# EAGLE design spindle_controller (EAGLE 9.5.1)
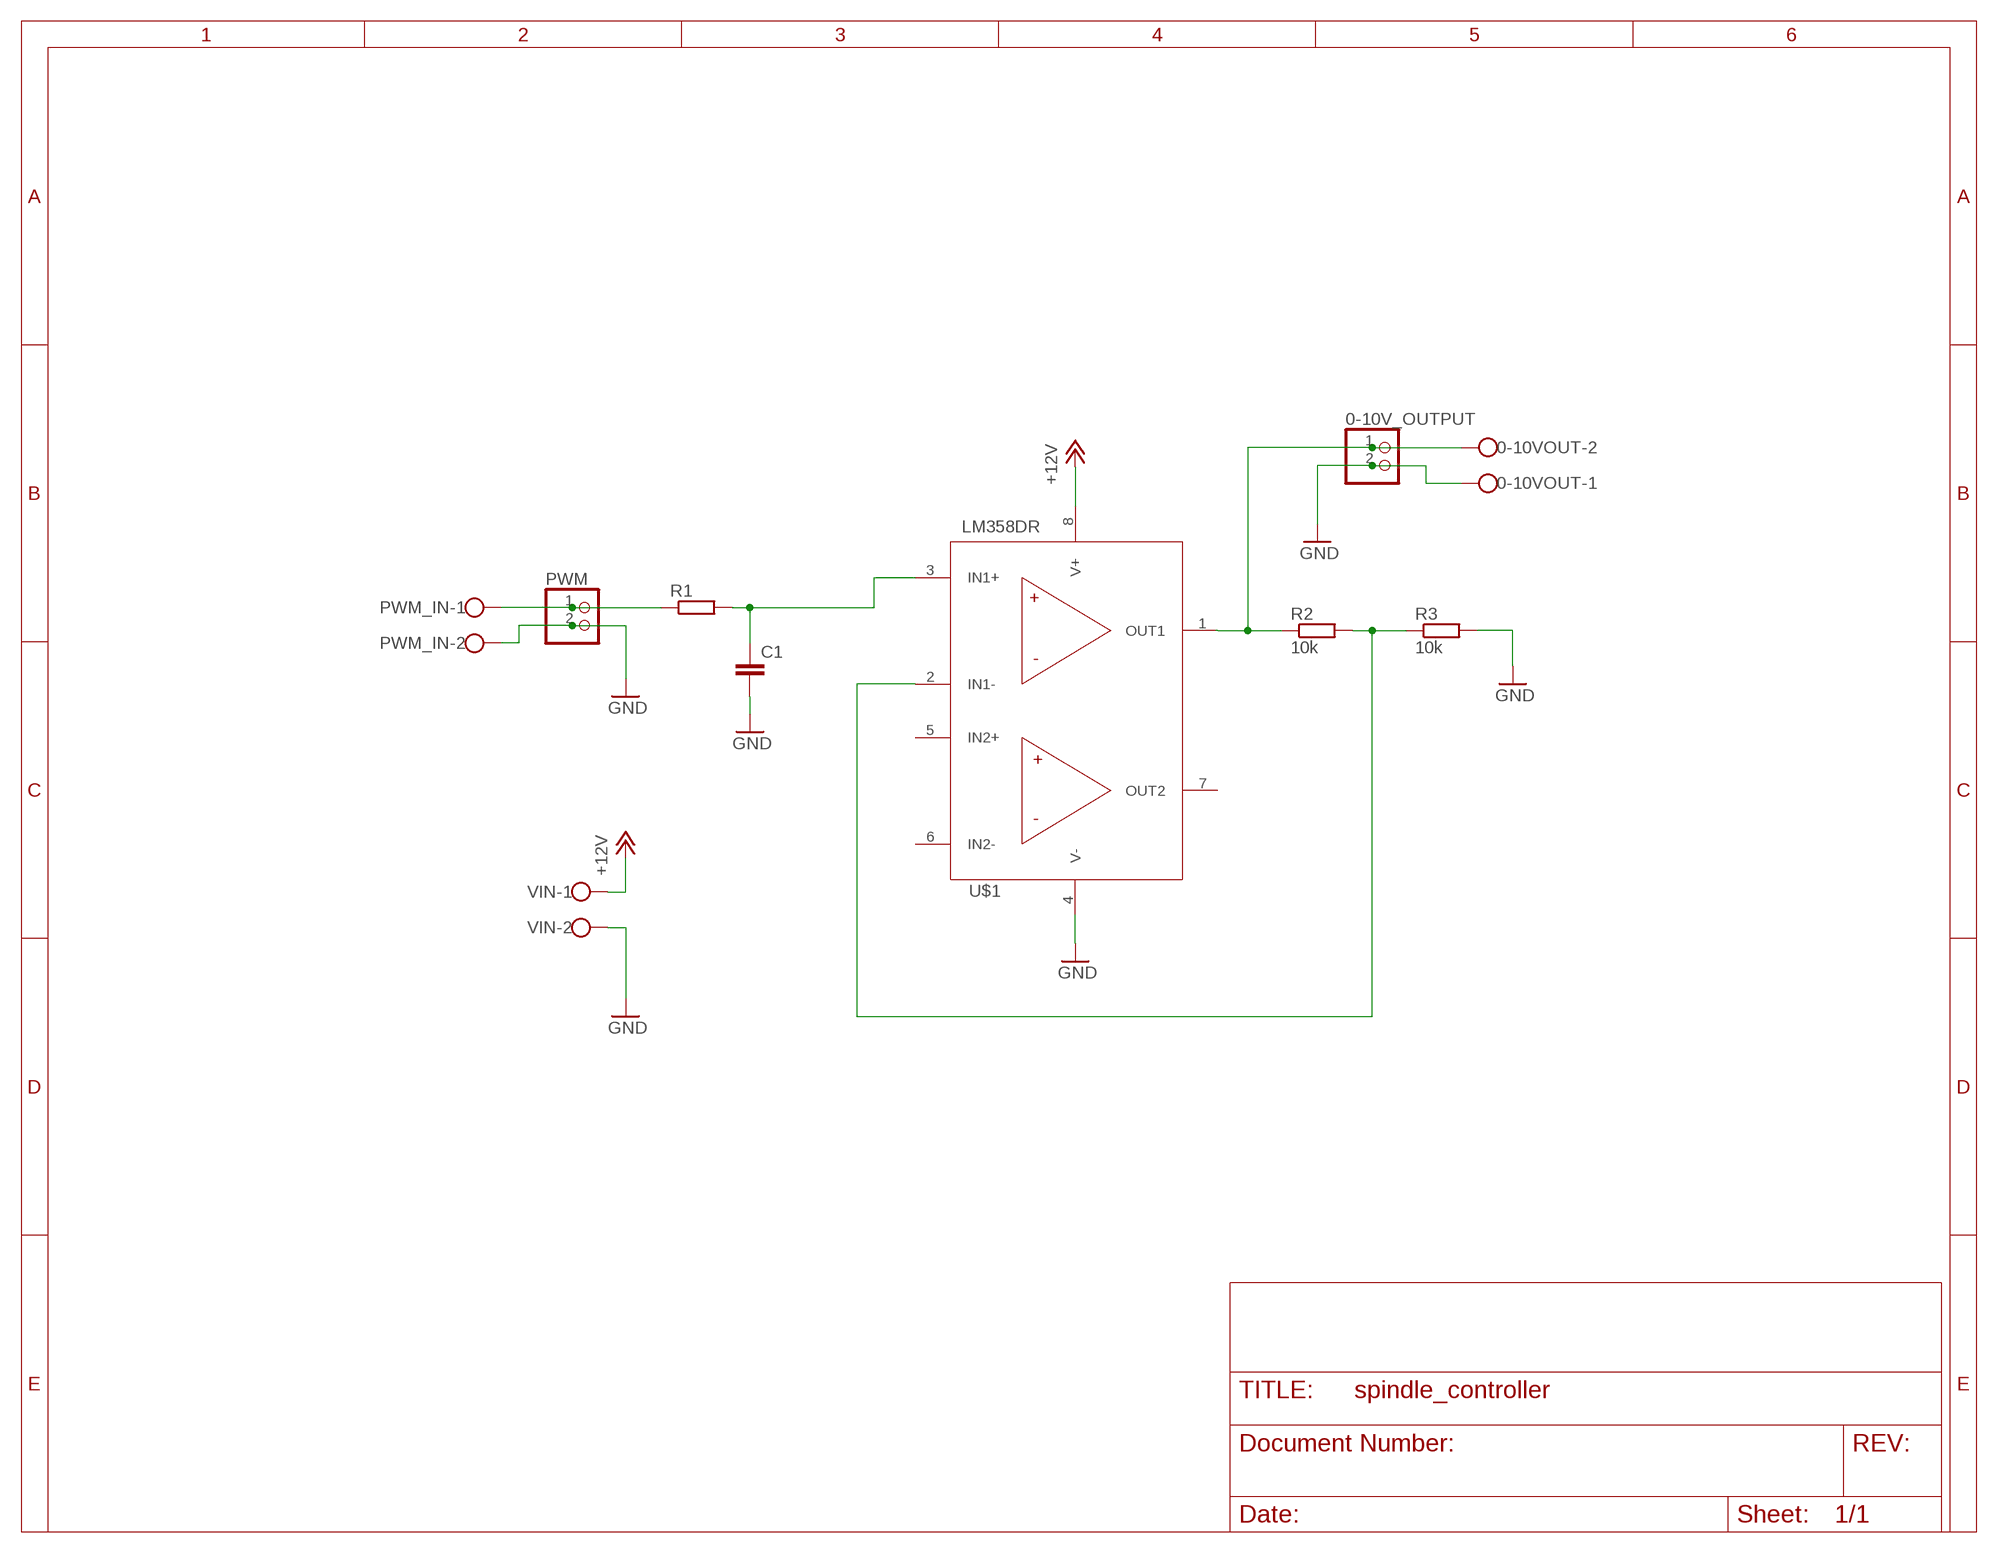
[diagram p0: schematic, sheet 1]

## Parts
0-10V_OUTPUT  PINHD-1X2  [1X02]
0-10VOUT  W237-102  [W237-102]
C1  C-EUC0603  [C0603]
PWM  PINHD-1X2  [1X02]
PWM_IN  W237-102  [W237-102]
R1  R-EU_R0603  [R0603]
R2  10k  R-EU_R0603  [R0603]
R3  10k  R-EU_R0603  [R0603]
U$1  LM358DRLM358DR_SOIC8  [SOIC127P599X175-8N]
VIN  W237-102  [W237-102]

## Nets
+12V: U$1.8(V+) VIN.1
GND: 0-10V_OUTPUT.2 0-10VOUT.1 C1.2 PWM.2 PWM_IN.2 R3.2 U$1.4(V-) VIN.2
N$1: PWM.1 PWM_IN.1 R1.1
N$2: C1.1 R1.2 U$1.3(IN1+)
N$3: R2.2 R3.1 U$1.2(IN1-)
N$4: 0-10V_OUTPUT.1 0-10VOUT.2 R2.1 U$1.1(OUT1)
Unconnected: U$1.5(IN2+) U$1.6(IN2-) U$1.7(OUT2)

## Library data of the parts
0-10V_OUTPUT PWM = pinhead:PINHD-1X2: PIN HEADER
0-10VOUT PWM_IN VIN = con-wago-500:W237-102: WAGO SCREW CLAMP; MPN: 237-102; OC_FARNELL: unknown; OC_NEWARK: 70K9898
C1 = rcl:C-EU: CAPACITOR, European symbol; SPICEPREFIX: C
R1-R3 = rcl:R-EU_: RESISTOR, European symbol; SPICEPREFIX: R
U$1 = NikodemBartnik:LM358DR: Operational Amplifiers - Op Amps Dual Op Amp 2 channel min 3V max 32V 30mA per channel

## Board
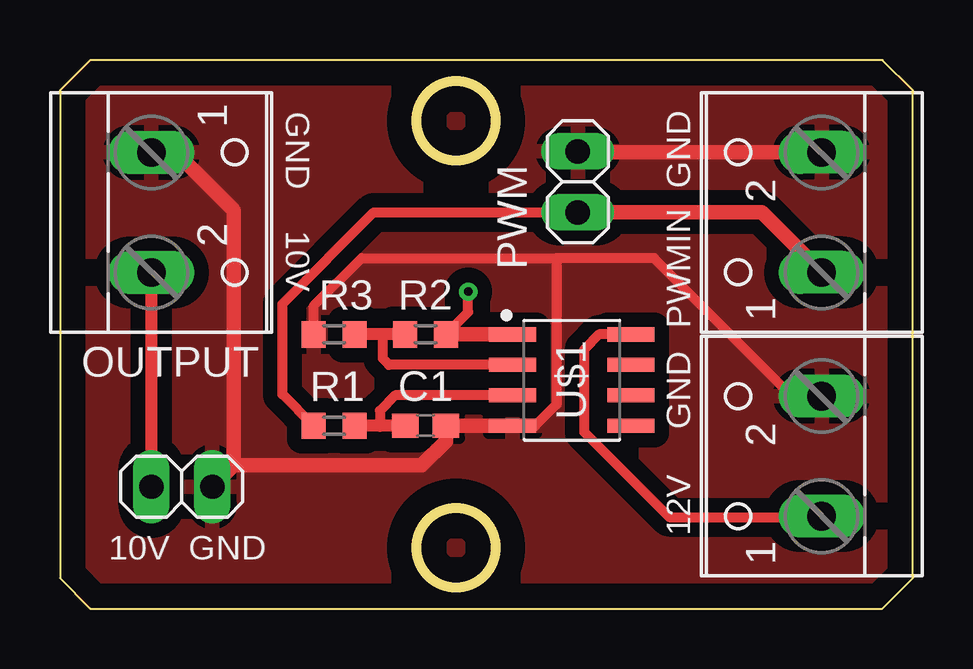
[diagram p1: board, top side]
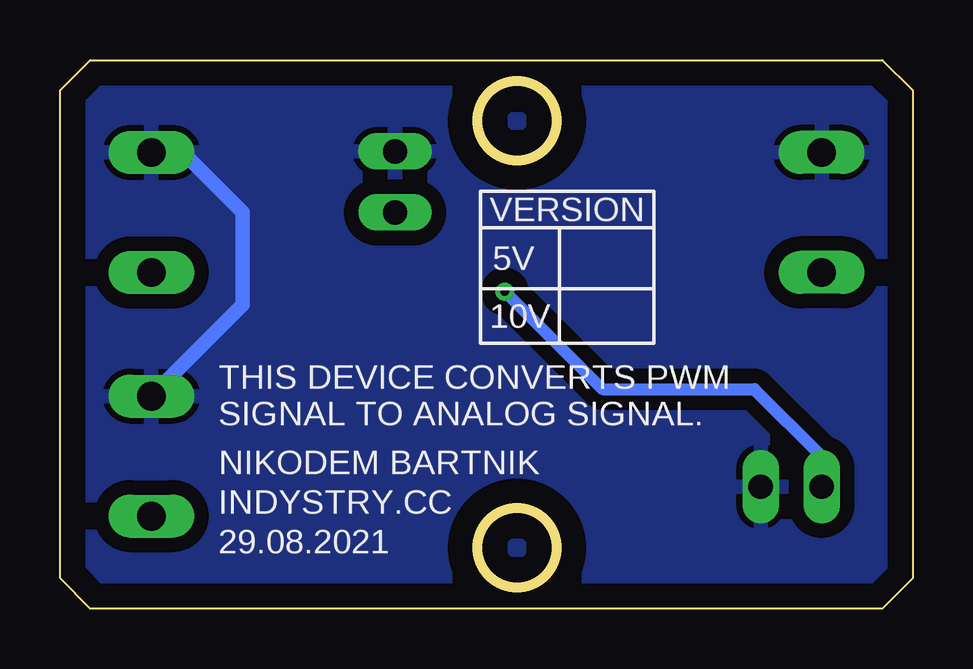
[diagram p2: board, bottom side, seen from below]

Size 35.56 x 22.86 mm. Coordinates in mm from the lower left corner, seen from the top.
Outline: 0,21.59 0,1.27 1.27,0 34.29,0 35.56,1.27 35.56,21.59 34.29,22.86 1.27,22.86 0,21.59
Outline: circle at 16.51,2.54 radius 1.65
Outline: circle at 16.51,20.32 radius 1.65
Copper layers (1*16): Top 0.035mm / dielectric 1.5mm / Bottom 0.035mm
Design rules "default": minimum track width 6mil, minimum drill 0.35mm, track to track 6mil, track to pad 6mil, pad to pad 6mil, via to via 6mil, smd to smd 6mil, copper to edge 40mil, drill to drill 6mil, minimum pad ring 10mil, minimum via ring 8mil, stop-mask expansion 4mil, vias tented up to drill 0mil, thermal gap 10mil

### Footprints (pad centres in the part's own frame; a part is rotated, then mirrored left to right if it is on the bottom)
1X02 = drill 1.016 long: 1 -1.27,0; 2 1.27,0
W237-102 = drill 1.194 long: 1 -2.5,-1.27; 2 2.5,-1.27
C0603 = smd 1.1 x 1: 1 -0.85,0; 2 0.85,0
R0603 = smd 1 x 1.1: 1 -0.85,0; 2 0.85,0
SOIC127P599X175-8N = smd 1.967 x 0.599: 1 -2.469,1.905; 2 -2.469,0.635; 3 -2.469,-0.635; 4 -2.469,-1.905; 5 2.469,-1.905; 6 2.469,-0.635; 7 2.469,0.635; 8 2.469,1.905

### Placement (x,y rotation side)
0-10V_OUTPUT  5.08,5.08 0 top
0-10VOUT  5.08,16.51 270 top
C1  15.24,7.62 0 top
PWM  21.59,17.78 90 top
PWM_IN  30.48,16.51 90 top
R1  11.43,7.62 0 top
R2  15.24,11.43 180 top
R3  11.43,11.43 180 top
U$1  21.34,9.53 0 top
VIN  30.48,6.35 90 top

### Tracks (layer width: path | path; a pad name or v marks a point on that pad's centre or on a via)
+12V
  Top 0.406: U$1.8 22.48,11.43 21.84,10.79 21.84,7.37 25.4,3.81 31.71,3.81 VIN.1
GND
  Top 0.305: PWM.2 21.63,19.01
  Top 0.406: R3.2 10.58,12.61 12.57,14.61 20.7,14.61 | U$1.4 19.81,7.62 20.7,8.51 20.7,14.61 | VIN.2 30.52,8.85 24.77,14.61 20.7,14.61
  Top 0.61: PWM_IN.2 21.63,19.01 | U$1.4 C1.2 16.09,6.99 15.07,5.97 7.24,5.97 | 0-10VOUT.1 4.83,19.01 7.24,16.6 7.24,5.97 | 7.24,5.97 0-10V_OUTPUT.2
  Bottom 0.406: PWM_IN.2 30.44,19.01
  Bottom 0.61: 30.44,19.01 27.94,16.51 27.94,12.66 VIN.2
  pour Top (isolate 0.61): 0,21.59 0,1.27 1.27,0 34.29,0 35.56,1.27 35.56,21.59 34.29,22.86 1.27,22.86
  pour Bottom (isolate 0.61): 0,21.59 0,1.27 1.27,0 34.29,0 35.56,1.27 35.56,21.59 34.29,22.86 1.27,22.86
N$1
  Top 0.406: R1.1 9.27,8.93 9.27,12.7 13.08,16.51 PWM.1
  Top 0.61: PWM_IN.1 29.25,16.51 PWM.1
N$2
  Top 0.406: U$1.3 13.97,8.89 13.34,8.26 13.34,7.62
  Top 0.508: C1.1 13.34,7.62 R1.2
N$3
  Top 0.406: 13.46,11.43 13.46,10.41 13.72,10.16 U$1.2
  Top 0.508: R2.2 13.46,11.43 R3.1
N$4  (via drill 0.35)
  Top 0.406: R2.1 17.02,12.36 v17.02,13.21
  Top 0.508: 0-10VOUT.2 0-10V_OUTPUT.1
  Top 0.61: U$1.1 R2.1
  Bottom 0.406: 3.81,6.35 0-10V_OUTPUT.1
  Bottom 0.508: v17.02,13.21 12.95,9.14 6.6,9.14 3.81,6.35

### Text on the board
tNames: GND | GND | 10V | PWMIN | OUTPUT | GND | 12V | 10V GND
bNames: VERSION | 5V | 10V | THIS DEVICE CONVERTS PWM / SIGNAL TO ANALOG SIGNAL. | NIKODEM BARTNIK | INDYSTRY.CC | 29.08.2021